# Altium schematic sheet PIC24FJ256GB106.SchDoc
size A4
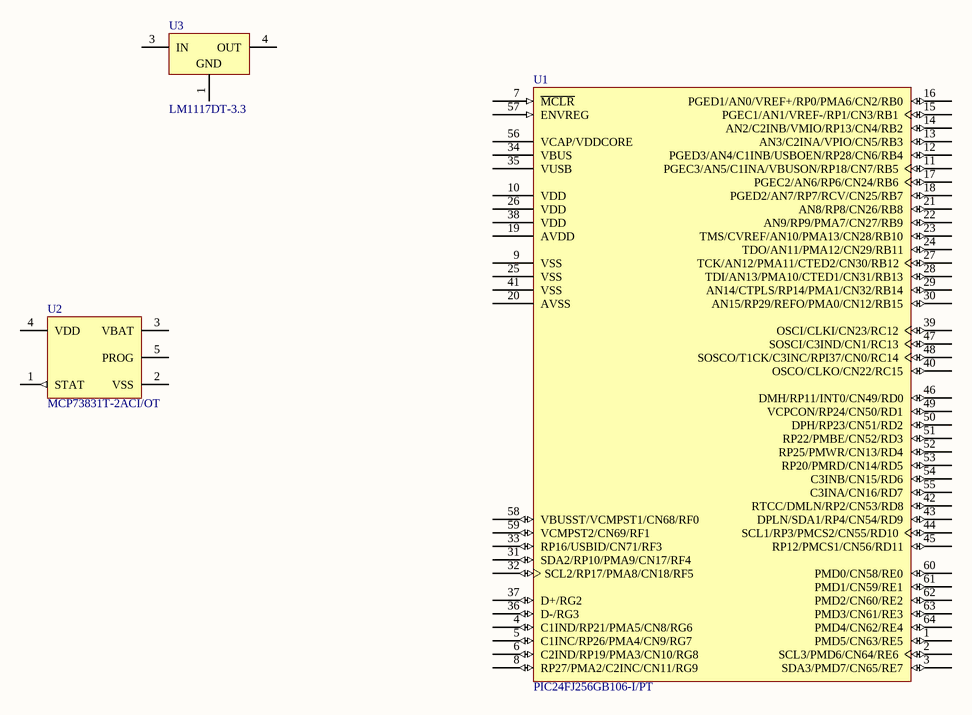
[diagram p0: PIC24FJ256GB106.SchDoc]

## Parts
U1  PIC24FJ256GB106-I/PT  [TQFP-PT64_N]
U2  MCP73831T-2ACI/OT  [SOT-23-OT5_N]
U3  LM1117DT-3.3  [TD03B_N]

## Nets

Not connected (* = marked no-connect by the designer): U1 1(PMD5/CN63/RE5) 2(SCL3/PMD6/CN64/RE6) 3(SDA3/PMD7/CN65/RE7) 4(C1IND/RP21/PMA5/CN8/RG6) 5(C1INC/RP26/PMA4/CN9/RG7) 6(C2IND/RP19/PMA3/CN10/RG8) 7(~{MCLR}) 8(RP27/PMA2/C2INC/CN11/RG9) 9(VSS) 10(VDD) 11(PGEC3/AN5/C1INA/VBUSON/RP18/CN7/RB5) 12(PGED3/AN4/C1INB/USBOEN/RP28/CN6/RB4) 13(AN3/C2INA/VPIO/CN5/RB3) 14(AN2/C2INB/VMIO/RP13/CN4/RB2) 15(PGEC1/AN1/VREF-/RP1/CN3/RB1) 16(PGED1/AN0/VREF+/RP0/PMA6/CN2/RB0) 17(PGEC2/AN6/RP6/CN24/RB6) 18(PGED2/AN7/RP7/RCV/CN25/RB7) 19(AVDD) 20(AVSS) 21(AN8/RP8/CN26/RB8) 22(AN9/RP9/PMA7/CN27/RB9) 23(TMS/CVREF/AN10/PMA13/CN28/RB10) 24(TDO/AN11/PMA12/CN29/RB11) 25(VSS) 26(VDD) 27(TCK/AN12/PMA11/CTED2/CN30/RB12) 28(TDI/AN13/PMA10/CTED1/CN31/RB13) 29(AN14/CTPLS/RP14/PMA1/CN32/RB14) 30(AN15/RP29/REFO/PMA0/CN12/RB15) 31(SDA2/RP10/PMA9/CN17/RF4) 32(SCL2/RP17/PMA8/CN18/RF5) 33(RP16/USBID/CN71/RF3) 34(VBUS) 35(VUSB) 36(D-/RG3) 37(D+/RG2) 38(VDD) 39(OSCI/CLKI/CN23/RC12) 40(OSCO/CLKO/CN22/RC15) 41(VSS) 42(RTCC/DMLN/RP2/CN53/RD8) 43(DPLN/SDA1/RP4/CN54/RD9) 44(SCL1/RP3/PMCS2/CN55/RD10) 45(RP12/PMCS1/CN56/RD11) 46(DMH/RP11/INT0/CN49/RD0) 47(SOSCI/C3IND/CN1/RC13) 48(SOSCO/T1CK/C3INC/RPI37/CN0/RC14) 49(VCPCON/RP24/CN50/RD1) 50(DPH/RP23/CN51/RD2) 51(RP22/PMBE/CN52/RD3) 52(RP25/PMWR/CN13/RD4) 53(RP20/PMRD/CN14/RD5) 54(C3INB/CN15/RD6) 55(C3INA/CN16/RD7) 56(VCAP/VDDCORE) 57(ENVREG) 58(VBUSST/VCMPST1/CN68/RF0) 59(VCMPST2/CN69/RF1) 60(PMD0/CN58/RE0) 61(PMD1/CN59/RE1) 62(PMD2/CN60/RE2) 63(PMD3/CN61/RE3) 64(PMD4/CN62/RE4); U2 1(STAT) 2(VSS) 3(VBAT) 4(VDD) 5(PROG); U3 1(GND) 3(IN) 4(OUT)

## Library data of the parts
U1 = PIC24FJ256GB106-I/PT: General Purpose 16-Bit Flash Microcontroller with USB On-The-Go, 256KB Flash, 16KB SRAM, 64-Pin TQFP, Industrial Temperature; Published: 29-Jan-2009; LatestRevisionDate: 07-Oct-2010; LatestRevisionNote: Updated to datasheet revision C, Dec-2009. Supplier links updated. Sch. pin names updated.; DatasheetVersion: revC, Dec-2009; PackageVersion: revBB, Aug-2009; PackageReference: TQFP-PT64; Publisher: Altium Limited; PackageDescription: 64-Lead Thin Plastic Quad Flat Pack (PT) - 10x10x1mm Body, 2.00mm [TQFP]; Supplier 1: Digi-Key; Supplier Part Number 1: PIC24FJ256GB106-I/PT-ND; Supplier 2: Farnell; Supplier Part Number 2: 1576868; Code_JEDEC: MS-026; ComponentLink1Description: Datasheet; ComponentLink1URL: http://ww1.microchip.com/downloads/en/DeviceDoc/39897c.pdf; ComponentLink2Description: Packaging Specification; ComponentLink2URL: http://www.microchip.com/stellent/groups/techpub_sg/documents/packagingspec/en012702.pdf; ComponentLink3Description: Microchip.com Home; ComponentLink3URL: http://www.microchip.com/
U2 = MCP73831T-2ACI/OT: Miniature Single-Cell, Fully Integrated Li-Ion, Li-Polymer Charge Management Controller, 4.2V, 5-Pin SOT-23, Industrial Temperature, Tape and Reel; Published: 29-Jan-2009; LatestRevisionDate: 27-Nov-2009; LatestRevisionNote: Updated to datasheet revision E, Sep-2008; DatasheetVersion: revE, Sep-2008; PackageVersion: revBB, Aug-2009; PackageReference: SOT-23-OT5; Publisher: Altium Limited; PackageDescription: 5-Lead Plastic Small Outline Transistor (OT) [SOT-23]; Supplier 1: Digi-Key; Supplier Part Number 1: MCP73831T-2ACI/OTTR-ND; Supplier 2: Digi-Key; Supplier Part Number 2: MCP73831T-2ACI/OTCT-ND; Supplier 3: Digi-Key; Supplier Part Number 3: MCP73831T-2ACI/OTDKR-ND; Supplier 4: Farnell; Supplier Part Number 4: 1332158; Code_IPC: SOT23-5; ComponentLink1Description: Datasheet; ComponentLink1URL: http://ww1.microchip.com/downloads/en/DeviceDoc/21984e.pdf; ComponentLink2Description: Packaging Specification; ComponentLink2URL: http://www.microchip.com/stellent/groups/techpub_sg/documents/packagingspec/en012702.pdf; ComponentLink3Description: Microchip.com Home; ComponentLink3URL: http://www.microchip.com/
U3 = LM1117DT-3.3: 800mA Low-Dropout Linear Regulator, 3-pin TO-252; Manufacturer: National Semiconductor; PackageTopMarking: NSUZXYTT*LM1117*DT-3.3; PowerWise: N; CompType: LDO IC; Published: 4-Dec-2008; DatasheetVersion: Apr-2006; PackageVersion: revD, Feb-2009; PackageReference: TD03B; Publisher: Altium Limited; PackageDescription: TO252, Molded, Jedec, 6.8 x 6.10 x 2.30mm Body, 3 Lead, 2.28mm Pitch, Surface Mount; Supplier 1: Farnell; Supplier Part Number 1: 9486275; Supplier 2: Farnell; Supplier Part Number 2: 1523829; PartNumber: LM1117DT-3.3; RoHS: N; PinCount: 3; Code_JEDEC: TO-252-AA; ComponentLink1Description: LM1117 Datasheet; ComponentLink1URL: http://www.national.com/ds/LM/LM1117.pdf; ComponentLink2Description: LM1117 Web Page; ComponentLink2URL: http://www.national.com/pf/LM/LM1117.html; ComponentLink3Description: TD03B Package Page; ComponentLink3URL: http://www.national.com/packaging/folders/td03b.html